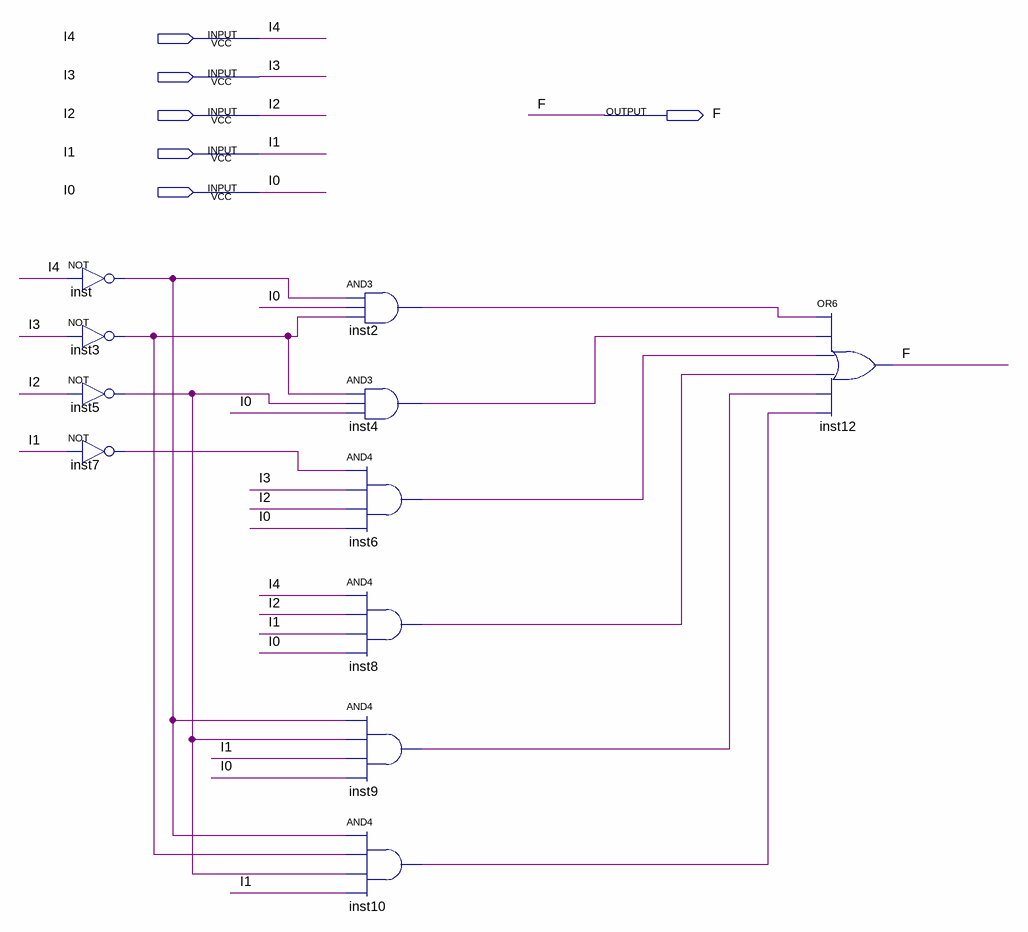
[diagram p0: schematic sheet]
// Quartus schematic circuit1.bdf as structural Verilog: 11 symbols, 6 pins
module circuit1 (
  input  I4,
  input  I3,
  input  I2,
  input  I1,
  input  I0,
  output F
);

  wire inst2_out, inst3_out, inst4_out, inst5_out, inst6_out, inst7_out, inst8_out, inst9_out, inst10_out,
       inst_out;

  not inst (inst_out, I4);
  not inst3 (inst3_out, I3);
  not inst5 (inst5_out, I2);
  not inst7 (inst7_out, I1);
  and inst2 (inst2_out, inst_out, I0, inst3_out);
  and inst4 (inst4_out, inst3_out, inst5_out, I0);
  and inst6 (inst6_out, inst7_out, I3, I2, I0);
  and inst8 (inst8_out, I4, I2, I1, I0);
  and inst9 (inst9_out, inst_out, inst5_out, I1, I0);
  and inst10 (inst10_out, inst_out, inst3_out, inst5_out, I1);
  or inst12 (F, inst2_out, inst4_out, inst6_out, inst8_out, inst9_out, inst10_out);
endmodule
